# EAGLE schematic teensy 4 x100 (EAGLE 7.7.0)

## Sheet 1 of 2
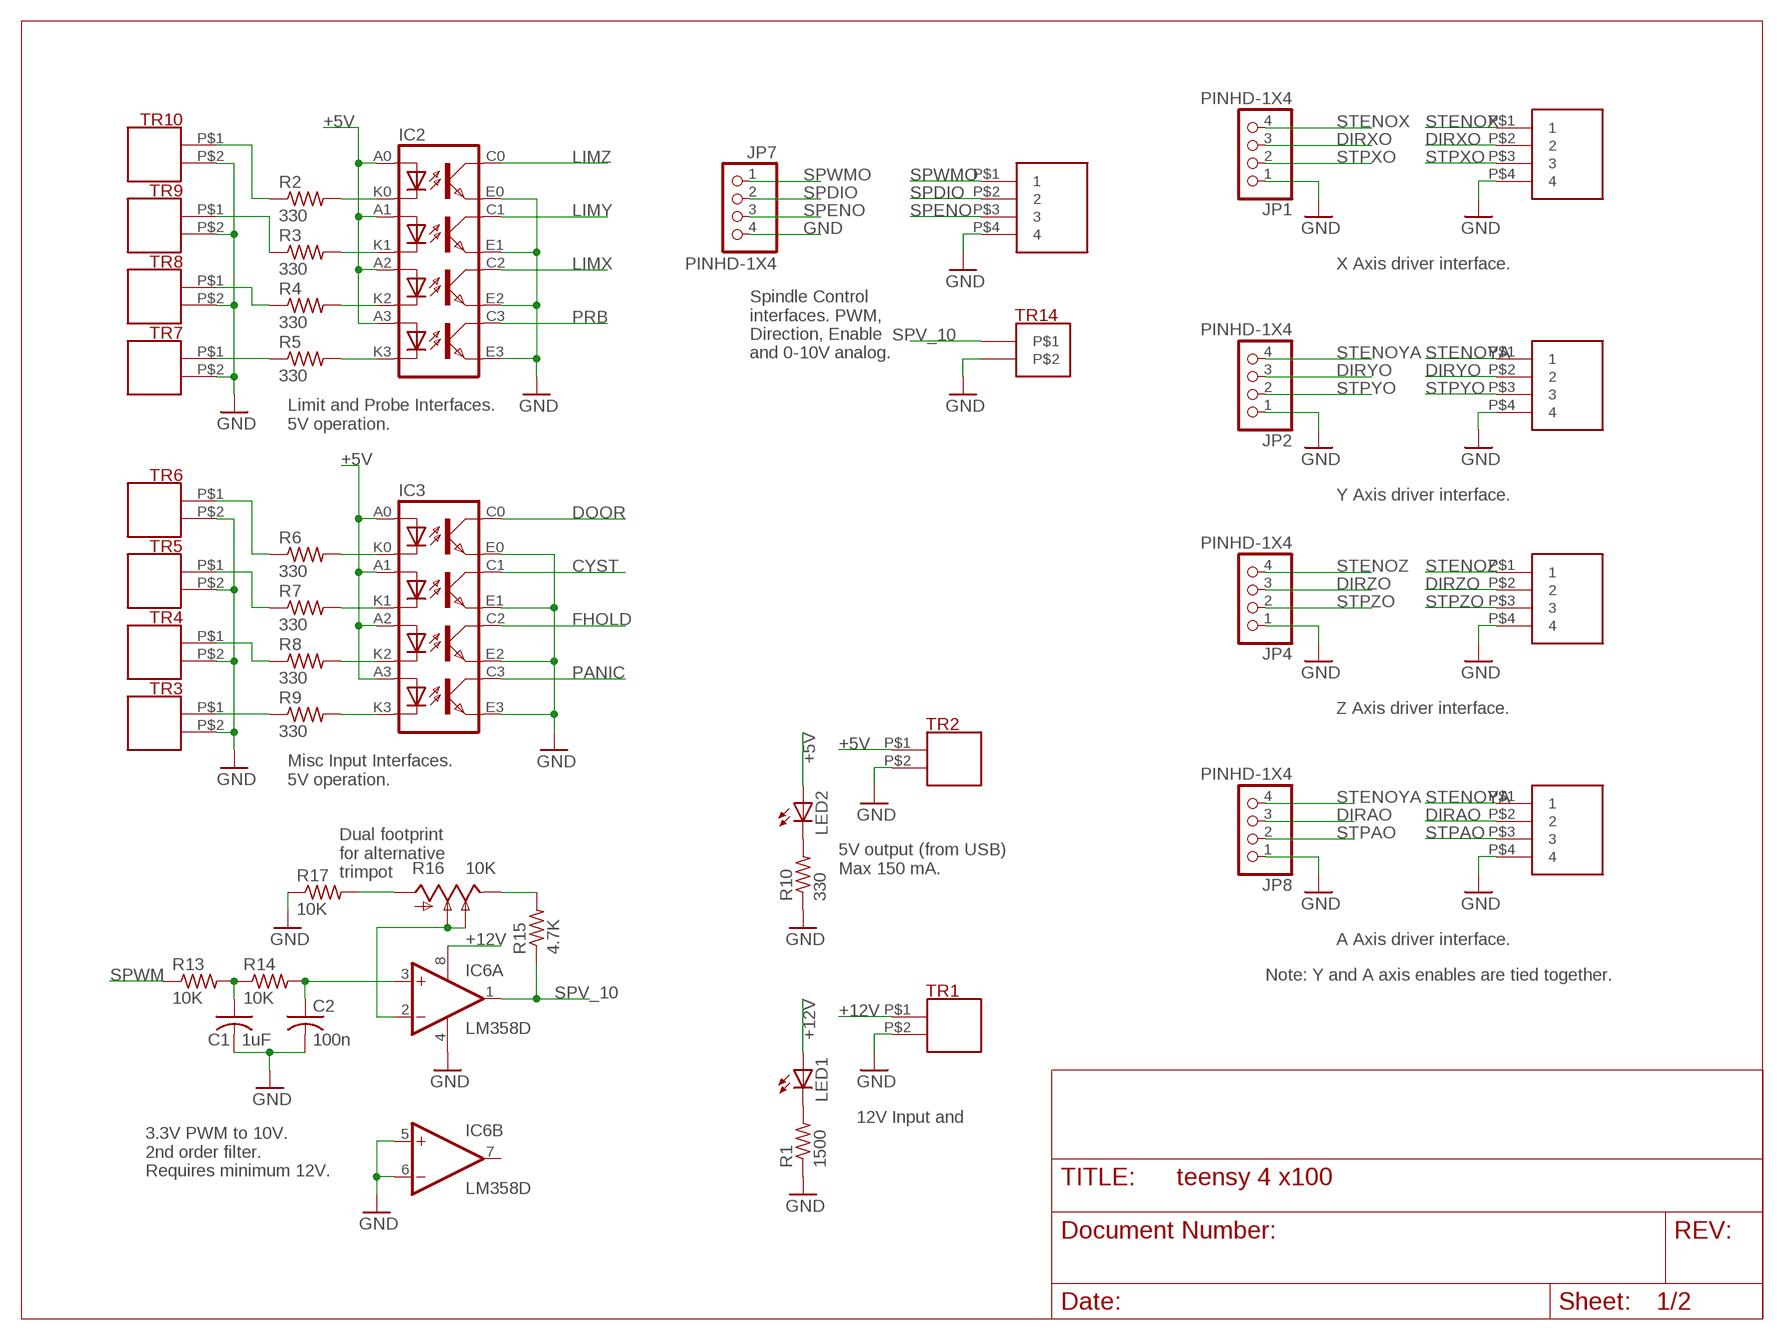
[diagram p0: schematic, sheet 1]

### Parts
C1  1uF  C-USC1206  [C1206]
C2  100n  C-USC1206  [C1206]
IC2  LTV846S  LVT846  [DIL16-SMD]
IC3  LTV846S  LVT846  [DIL16-SMD]
IC6  LM358D  [SO08]
JP1  PINHD-1X4  [1X04]
JP2  PINHD-1X4  [1X04]
JP4  PINHD-1X4  [1X04]
JP7  PINHD-1X4  [1X04]
JP8  PINHD-1X4  [1X04]
LED1  LED3MM  [LED3MM]
LED2  LED3MM  [LED3MM]
R1  1500  R-US_R1206  [R1206]
R2  330  R-US_R1206  [R1206]
R3  330  R-US_R1206  [R1206]
R4  330  R-US_R1206  [R1206]
R5  330  R-US_R1206  [R1206]
R6  330  R-US_R1206  [R1206]
R7  330  R-US_R1206  [R1206]
R8  330  R-US_R1206  [R1206]
R9  330  R-US_R1206  [R1206]
R10  330  R-US_R1206  [R1206]
R13  10K  R-US_R1206  [R1206]
R14  10K  R-US_R1206  [R1206]
R15  4.7K  R-US_R1206  [R1206]
R16  10K  TIMPOT_102  [B64Y]
R17  10K  R-US_R1206  [R1206]
TR1  T35-2  [T35-2]
TR2  T35-2  [T35-2]
TR3  T35-2  [T35-2]
TR4  T35-2  [T35-2]
TR5  T35-2  [T35-2]
TR6  T35-2  [T35-2]
TR7  T35-2  [T35-2]
TR8  T35-2  [T35-2]
TR9  T35-2  [T35-2]
TR10  T35-2  [T35-2]
TR11  T35-4  [T35-4]
TR12  T35-4  [T35-4]
TR13  T35-4  [T35-4]
TR14  T35-2  [T35-2]
TR19  T35-4  [T35-4]
TR20  T35-4  [T35-4]

### Nets
+5V: IC2.A0 IC2.A1 IC2.A2 IC2.A3 IC3.A0 IC3.A1 IC3.A2 IC3.A3 LED2.A TR2.P$1 ; also sheet 2
+12V: IC6.8(P:V+) LED1.A TR1.P$1 ; also sheet 2
CYST: IC3.C1(COL1) ; also sheet 2
DIRAO: JP8.3 TR20.P$2 ; also sheet 2
DIRXO: JP1.3 TR11.P$2 ; also sheet 2
DIRYO: JP2.3 TR12.P$2 ; also sheet 2
DIRZO: JP4.3 TR13.P$2 ; also sheet 2
DOOR: IC3.C0(COL0) ; also sheet 2
FHOLD: IC3.C2(COL2) ; also sheet 2
GND: C1.2 C2.2 IC2.E0(EMIT0) IC2.E1(EMIT1) IC2.E2(EMIT2) IC2.E3(EMIT3) IC3.E0(EMIT0) IC3.E1(EMIT1) IC3.E2(EMIT2) IC3.E3(EMIT3) IC6.4(P:V-) IC6.5(B:+IN) IC6.6(B:-IN) JP1.1 JP2.1 JP4.1 JP7.4 JP8.1 R1.1 R10.1 R17.1 TR1.P$2 TR2.P$2 TR3.P$2 TR4.P$2 TR5.P$2 TR6.P$2 TR7.P$2 TR8.P$2 TR9.P$2 TR10.P$2 TR11.P$4 TR12.P$4 TR13.P$4 TR14.P$2 TR19.P$4 TR20.P$4 ; also sheet 2
LIMX: IC2.C2(COL2) ; also sheet 2
LIMY: IC2.C1(COL1) ; also sheet 2
LIMZ: IC2.C0(COL0) ; also sheet 2
N$1: IC3.K0(C0) R6.2
N$2: LED2.K(C) R10.2
N$3: IC3.K1(C1) R7.2
N$4: LED1.K(C) R1.2
N$5: IC3.K2(C2) R8.2
N$6: IC2.K0(C0) R2.2
N$7: IC2.K1(C1) R3.2
N$8: IC2.K2(C2) R4.2
N$9: IC2.K3(C3) R5.2
N$10: IC3.K3(C3) R9.2
N$20: C1.1 R13.2 R14.1
N$21: C2.1 IC6.3(A:+IN) R14.2
N$22: R15.2 R16.E
N$23: IC6.2(A:-IN) R16.S R16.S1
N$24: R16.A R17.2
N$28: R2.1 TR10.P$1
N$29: R3.1 TR9.P$1
N$30: R4.1 TR8.P$1
N$31: R5.1 TR7.P$1
N$32: R6.1 TR6.P$1
N$33: R7.1 TR5.P$1
N$34: R8.1 TR4.P$1
N$35: R9.1 TR3.P$1
PANIC: IC3.C3(COL3) ; also sheet 2
PRB: IC2.C3(COL3) ; also sheet 2
SPDIO: JP7.2 TR19.P$2 ; also sheet 2
SPENO: JP7.3 TR19.P$3 ; also sheet 2
SPV_10: IC6.1(A:OUT) R15.1 TR14.P$1
SPWM: R13.1 ; also sheet 2
SPWMO: JP7.1 TR19.P$1 ; also sheet 2
STENOX: JP1.4 TR11.P$1 ; also sheet 2
STENOYA: JP2.4 JP8.4 TR12.P$1 TR20.P$1 ; also sheet 2
STENOZ: JP4.4 TR13.P$1 ; also sheet 2
STPAO: JP8.2 TR20.P$3 ; also sheet 2
STPXO: JP1.2 TR11.P$3 ; also sheet 2
STPYO: JP2.2 TR12.P$3 ; also sheet 2
STPZO: JP4.2 TR13.P$3 ; also sheet 2
Unconnected: IC6.7(B:OUT)

### Notes on the sheet
- X Axis driver interface.
- Spindle Control
  interfaces. PWM,
  Direction, Enable
  and 0-10V analog.
- Limit and Probe Interfaces.
  5V operation.
- Y Axis driver interface.
- Z Axis driver interface.
- Misc Input Interfaces.
  5V operation.
- 5V output (from USB)
  Max 150 mA.
- Dual footprint
  for alternative
  trimpot
- A Axis driver interface.
- Note: Y and A axis enables are tied together.
- 12V Input and
- 3.3V PWM to 10V.
  2nd order filter.
  Requires minimum 12V.

## Sheet 2 of 2
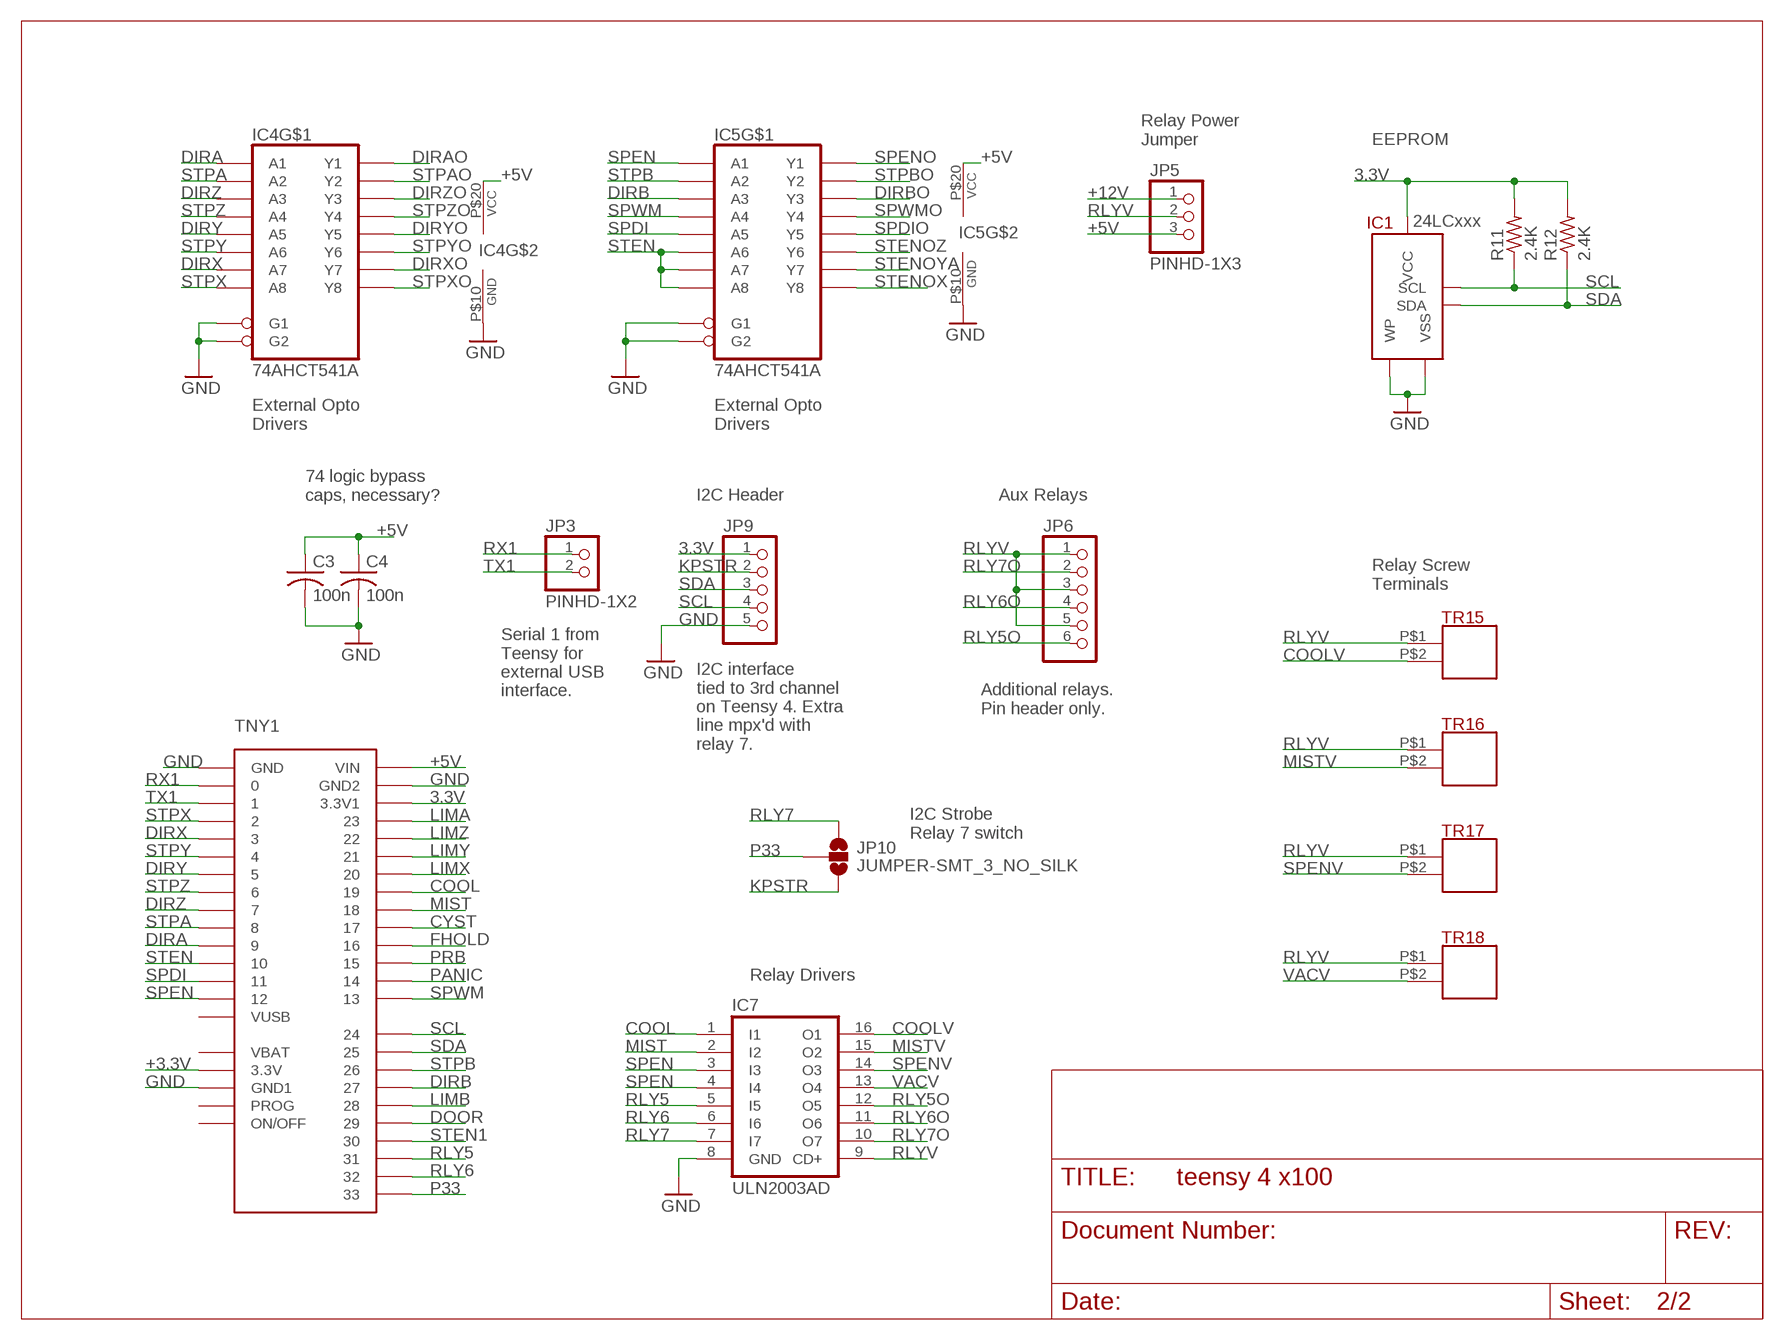
[diagram p1: schematic, sheet 2]

### Parts
C3  100n  C-USC1206  [C1206]
C4  100n  C-USC1206  [C1206]
IC1  24LCxxx  24CWXXX  [SOIC-8(MICROCHIP)]
IC4  74AHCT541A  [TSSOP20]
IC5  74AHCT541A  [TSSOP20]
IC7  ULN2003AD  [SO16]
JP3  PINHD-1X2  [1X02]
JP5  PINHD-1X3  [1X03]
JP6  PINHD-1X6  [1X06]
JP9  PINHD-1X5  [1X05]
JP10  JUMPER-SMT_3_NO_SILK  [SMT-JUMPER_3_NO_SILK]
R11  2.4K  R-US_R1206  [R1206]
R12  2.4K  R-US_R1206  [R1206]
TNY1  TEENSY4.0  [TEENSY4.0]
TR15  T35-2  [T35-2]
TR16  T35-2  [T35-2]
TR17  T35-2  [T35-2]
TR18  T35-2  [T35-2]

### Nets
3.3V: IC1.P$8(VCC) JP9.1 R11.2 R12.2 TNY1.3.31(3.3V1)
+3.3V: TNY1.3.30(3.3V)
+5V: C3.1 C4.1 IC4.P$20(VCC) IC5.P$20(VCC) JP5.3 TNY1.VIN ; also sheet 1
+12V: JP5.1 ; also sheet 1
COOL: IC7.1(I1) TNY1.19
COOLV: IC7.16(O1) TR15.P$2
CYST: TNY1.17 ; also sheet 1
DIRA: IC4.P$2(A1) TNY1.9
DIRAO: IC4.P$18(Y1) ; also sheet 1
DIRB: IC5.P$4(A3) TNY1.27
DIRBO: IC5.P$16(Y3)
DIRX: IC4.P$8(A7) TNY1.3
DIRXO: IC4.P$12(Y7) ; also sheet 1
DIRY: IC4.P$6(A5) TNY1.5
DIRYO: IC4.P$14(Y5) ; also sheet 1
DIRZ: IC4.P$4(A3) TNY1.7
DIRZO: IC4.P$16(Y3) ; also sheet 1
DOOR: TNY1.29 ; also sheet 1
FHOLD: TNY1.16 ; also sheet 1
GND: C3.2 C4.2 IC1.P$4(VSS) IC1.P$7(WP) IC4.P$1(G1) IC4.P$10(GND) IC4.P$19(G2) IC5.P$1(G1) IC5.P$10(GND) IC5.P$19(G2) IC7.8(GND) JP9.5 TNY1.GND TNY1.GND1 TNY1.GND2 ; also sheet 1
KPSTR: JP9.2 JP10.3
LIMA: TNY1.23
LIMB: TNY1.28
LIMX: TNY1.20 ; also sheet 1
LIMY: TNY1.21 ; also sheet 1
LIMZ: TNY1.22 ; also sheet 1
MIST: IC7.2(I2) TNY1.18
MISTV: IC7.15(O2) TR16.P$2
P33: JP10.2 TNY1.33
PANIC: TNY1.14 ; also sheet 1
PRB: TNY1.15 ; also sheet 1
RLY5: IC7.5(I5) TNY1.31
RLY5O: IC7.12(O5) JP6.6
RLY6: IC7.6(I6) TNY1.32
RLY6O: IC7.11(O6) JP6.4
RLY7: IC7.7(I7) JP10.1
RLY7O: IC7.10(O7) JP6.2
RLYV: IC7.9(CD+) JP5.2 JP6.1 JP6.3 JP6.5 TR15.P$1 TR16.P$1 TR17.P$1 TR18.P$1
RX1: JP3.1 TNY1.0
SCL: IC1.P$6(SCL) JP9.4 R11.1 TNY1.24
SDA: IC1.P$5(SDA) JP9.3 R12.1 TNY1.25
SPDI: IC5.P$6(A5) TNY1.11
SPDIO: IC5.P$14(Y5) ; also sheet 1
SPEN: IC5.P$2(A1) IC7.3(I3) IC7.4(I4) TNY1.12
SPENO: IC5.P$18(Y1) ; also sheet 1
SPENV: IC7.14(O3) TR17.P$2
SPWM: IC5.P$5(A4) TNY1.13 ; also sheet 1
SPWMO: IC5.P$15(Y4) ; also sheet 1
STEN: IC5.P$7(A6) IC5.P$8(A7) IC5.P$9(A8) TNY1.10
STEN1: TNY1.30
STENOX: IC5.P$11(Y8) ; also sheet 1
STENOYA: IC5.P$12(Y7) ; also sheet 1
STENOZ: IC5.P$13(Y6) ; also sheet 1
STPA: IC4.P$3(A2) TNY1.8
STPAO: IC4.P$17(Y2) ; also sheet 1
STPB: IC5.P$3(A2) TNY1.26
STPBO: IC5.P$17(Y2)
STPX: IC4.P$9(A8) TNY1.2
STPXO: IC4.P$11(Y8) ; also sheet 1
STPY: IC4.P$7(A6) TNY1.4
STPYO: IC4.P$13(Y6) ; also sheet 1
STPZ: IC4.P$5(A4) TNY1.6
STPZO: IC4.P$15(Y4) ; also sheet 1
TX1: JP3.2 TNY1.1
VACV: IC7.13(O4) TR18.P$2
Unconnected: TNY1.ON/OFF TNY1.PROG TNY1.VBAT TNY1.VUSB

### Notes on the sheet
- Relay Power
  Jumper
- EEPROM
- External Opto
  Drivers
- External Opto
  Drivers
- 74 logic bypass
  caps, necessary?
- I2C Header | Aux Relays
- Relay Screw
  Terminals
- Serial 1 from
  Teensy for
  external USB
  interface.
- Additional relays. 
  Pin header only.
- I2C interface
  tied to 3rd channel
  on Teensy 4. Extra
  line mpx'd with 
  relay 7.
- I2C Strobe
  Relay 7 switch
- Relay Drivers

## Library data of the parts
C1-C4 = rcl:C-US: CAPACITOR, American symbol
IC1 = phils-ic:24CWXXX
IC2 IC3 = phils optos:LVT846
IC4 IC5 = phils-ic:74AHCT541A
IC6 = linear:LM358: OP AMP also LM158; LM258; LM2904 Source: http://cache.national.com/ds/LM/LM158.pdf
IC7 = uln-udn:ULN2003A: DRIVER ARRAY
JP1 JP2 JP4 JP7 JP8 = T35:PINHD-1X4: PIN HEADER
JP3 = phils connectors:PINHD-1X2: PIN HEADER
JP5 = phils connectors:PINHD-1X3: PIN HEADER
JP6 = phils connectors:PINHD-1X6: PIN HEADER
JP9 = phils connectors:PINHD-1X5: PIN HEADER
JP10 = phils connectors:JUMPER-SMT_3_NO: Normally open jumper This jumper has three pads in close proximity to each other. Apply solder to close the connection(s).
LED1 LED2 = led:LED: LED OSRAM: - CHIPLED LG R971, LG N971, LY N971, LG Q971, LY Q971, LO R971, LY R971 LH N974, LH R974 LS Q976, LO Q976, LY Q976 LO Q996 - Hyper CHIPLED LW Q18S LB Q993, LB Q99A, LB R99A - SideLED LS A670, LO A670, LY A670, LG A670, LP A670 LB A673, LV A673, LT A673, LW A673 LH A674 LY A675 LS A676, LA A676, LO A676, LY A676, LW A676 LS A679, LY A679, LG A679 - Hyper Micro SIDELED® LS Y876, LA Y876, LO Y876, LY Y876 LT Y87S - SmartLED LW L88C, LW L88S LB L89C, LB L89S, LG L890 LS L89K, LO L89K, LY L89K LS L896, LA L896, LO L896, LY L896 - TOPLED LS T670, LO T670, LY T670, LG T670, LP T670 LSG T670, LSP T670, LSY T670, LOP T670, LYG T670 LG T671, LOG T671, LSG T671 LB T673, LV T673, LT T673, LW T673 LH T674 LS T676, LA T676, LO T676, LY T676, LB T676, LH T676, LSB T676, LW T676 LB T67C, LV T67C, LT T67C, LS T67K, LO T67K, LY T67K, LW E67C LS E67B, LA E67B, LO E67B, LY E67B, LB E67C, LV E67C, LT E67C LW T67C LS T679, LY T679, LG T679 LS T770, LO T770, LY T770, LG T770, LP T770 LB T773, LV T773, LT T773, LW T773 LH T774 LS E675, LA E675, LY E675, LS T675 LS T776, LA T776, LO T776, LY T776, LB T776 LHGB T686 LT T68C, LB T68C - Hyper Mini TOPLED® LB M676 - Mini TOPLED Santana® LG M470 LS M47K, LO M47K, LY M47K Source: http://www.osram.convergy.de LUXEON: - LUMILED® LXK2-PW12-R00, LXK2-PW12-S00, LXK2-PW14-U00, LXK2-PW14-V00 LXK2-PM12-R00, LXK2-PM12-S00, LXK2-PM14-U00 LXK2-PE12-Q00, LXK2-PE12-R00, LXK2-PE12-S00, LXK2-PE14-T00, LXK2-PE14-U00 LXK2-PB12-K00, LXK2-PB12-L00, LXK2-PB12-M00, LXK2-PB14-N00, LXK2-PB14-P00, LXK2-PB14-Q00 LXK2-PR12-L00, LXK2-PR12-M00, LXK2-PR14-Q00, LXK2-PR14-R00 LXK2-PD12-Q00, LXK2-PD12-R00, LXK2-PD12-S00 LXK2-PH12-R00, LXK2-PH12-S00 LXK2-PL12-P00, LXK2-PL12-Q00, LXK2-PL12-R00 Source: www.luxeon.com KINGBRIGHT: KA-3528ASYC Source: www.kingbright.com
R1-R15 R17 = rcl:R-US_: RESISTOR, American symbol
R16 = phils:TIMPOT_102
TNY1 = phils modules:TEENSY4.0
TR1-TR10 TR15-TR18 = phils connectors:T35-2
TR11-TR13 TR19 TR20 = T35:T35-4
TR14 = T35:T35-2